# EAGLE design valves card (EAGLE 9.6.2)
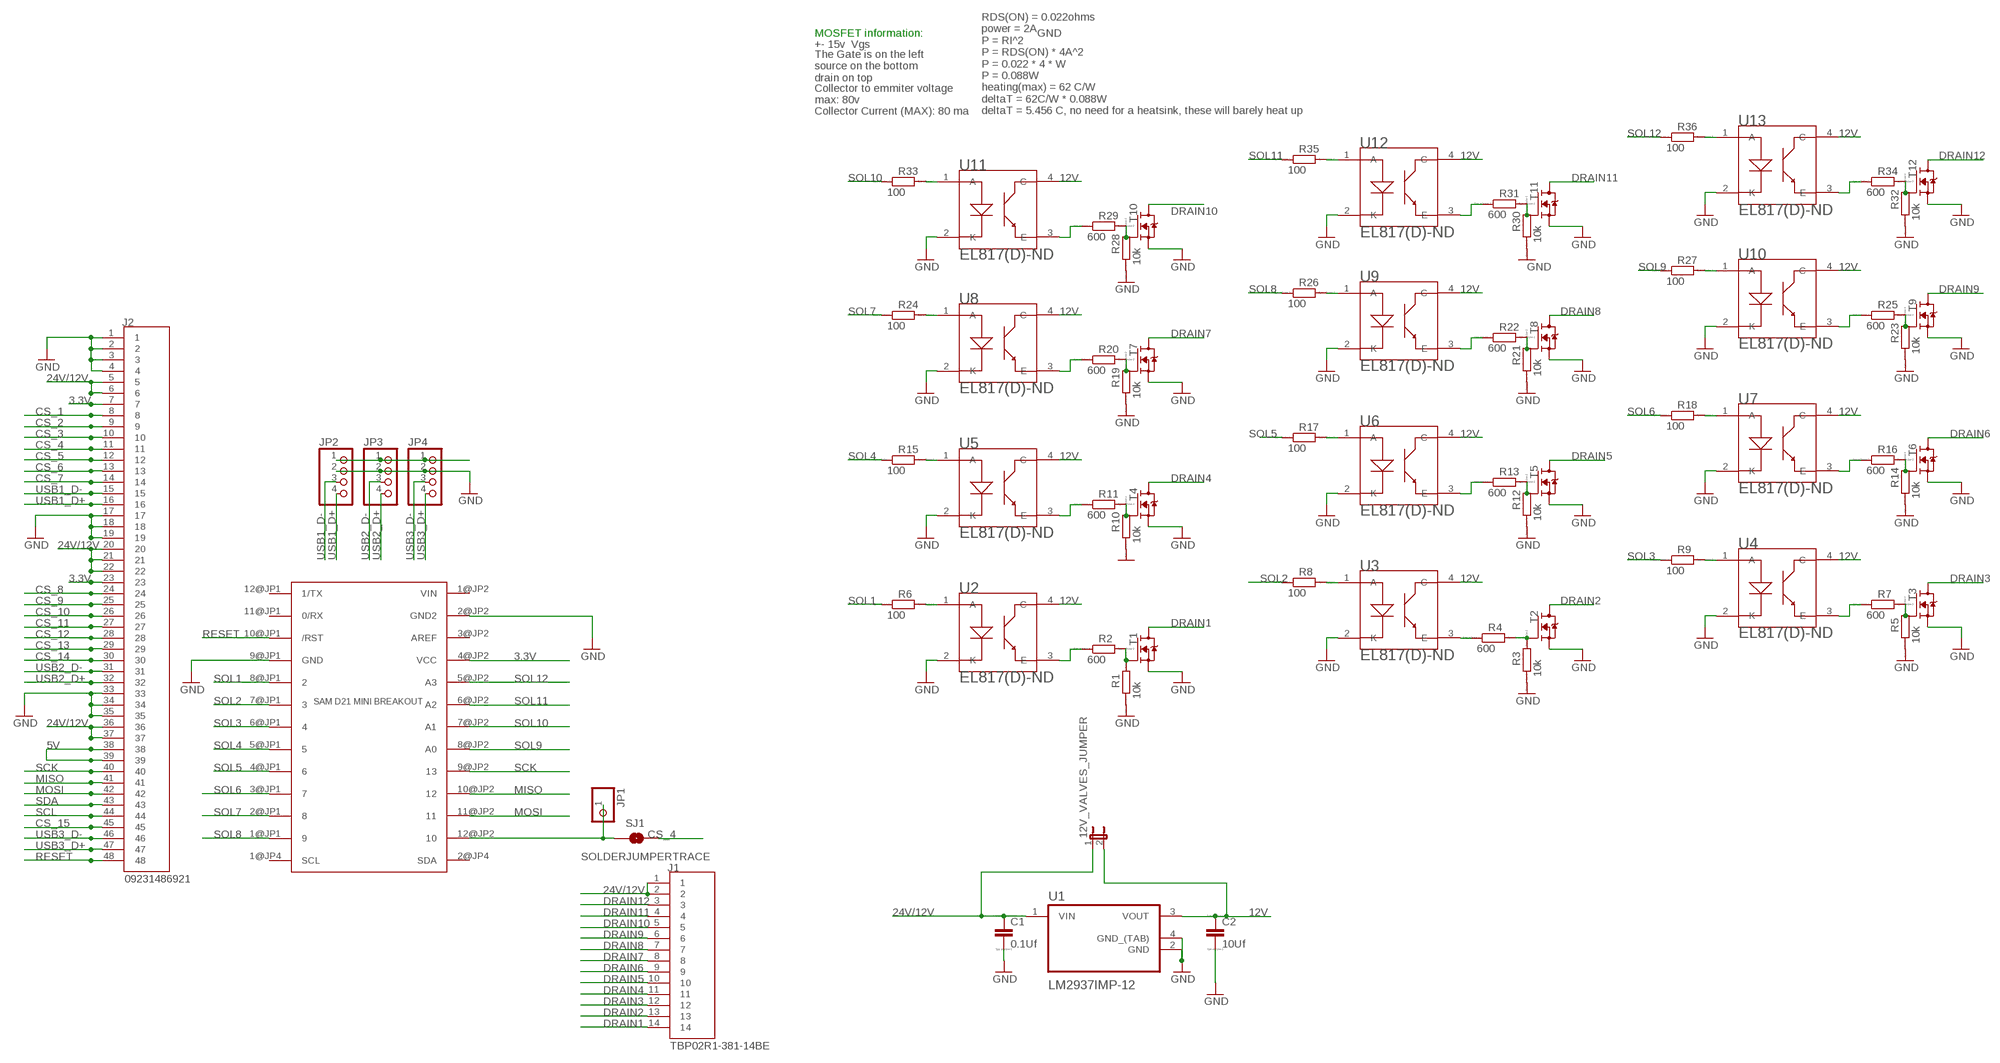
[diagram p0: schematic, sheet 1]

## Parts
12V_VALVES_JUMPER  JUMPER-2SMD-NO  [SJ_2S-NO]
C1  0.1Uf  C  [C0805]
C2  10Uf  CC1206  [C1206]
J1  TBP02R1-381-14BE  [CUI_TBP02R1-381-14BE]
J2  09231486921  [HARTING_09231486921]
JP1  PINHD-1X1  [1X01]
JP2  PINHD-1X4  [1X04]
JP3  PINHD-1X4  [1X04]
JP4  PINHD-1X4  [1X04]
M2  SAM_D21_MINI_BREAKOUT  [JP1_SPARKFUN-SAMD21-MINI-BREAKOUT-V10]
R1  10k  R  [R0805]
R2  600  R  [R0805]
R3  10k  R  [R0805]
R4  600  R  [R0805]
R5  10k  R  [R0805]
R6  100  R  [R0805]
R7  600  R  [R0805]
R8  100  R  [R0805]
R9  100  R  [R0805]
R10  10k  R  [R0805]
R11  600  R  [R0805]
R12  10k  R  [R0805]
R13  600  R  [R0805]
R14  10k  R  [R0805]
R15  100  R  [R0805]
R16  600  R  [R0805]
R17  100  R  [R0805]
R18  100  R  [R0805]
R19  10k  R  [R0805]
R20  600  R  [R0805]
R21  10k  R  [R0805]
R22  600  R  [R0805]
R23  10k  R  [R0805]
R24  100  R  [R0805]
R25  600  R  [R0805]
R26  100  R  [R0805]
R27  100  R  [R0805]
R28  10k  R  [R0805]
R29  600  R  [R0805]
R30  10k  R  [R0805]
R31  600  R  [R0805]
R32  10k  R  [R0805]
R33  100  R  [R0805]
R34  600  R  [R0805]
R35  100  R  [R0805]
R36  100  R  [R0805]
SJ1  SOLDERJUMPERTRACE  [SJ_2S-TRACE]
T1  IRLZ44NSTRLPBF  BUK9214-30A-118-DPAK  [DPAK_TO252]
T2  IRLZ44NSTRLPBF  BUK9214-30A-118-DPAK  [DPAK_TO252]
T3  IRLZ44NSTRLPBF  BUK9214-30A-118-DPAK  [DPAK_TO252]
T4  IRLZ44NSTRLPBF  BUK9214-30A-118-DPAK  [DPAK_TO252]
T5  IRLZ44NSTRLPBF  BUK9214-30A-118-DPAK  [DPAK_TO252]
T6  IRLZ44NSTRLPBF  BUK9214-30A-118-DPAK  [DPAK_TO252]
T7  IRLZ44NSTRLPBF  BUK9214-30A-118-DPAK  [DPAK_TO252]
T8  IRLZ44NSTRLPBF  BUK9214-30A-118-DPAK  [DPAK_TO252]
T9  IRLZ44NSTRLPBF  BUK9214-30A-118-DPAK  [DPAK_TO252]
T10  IRLZ44NSTRLPBF  BUK9214-30A-118-DPAK  [DPAK_TO252]
T11  IRLZ44NSTRLPBF  BUK9214-30A-118-DPAK  [DPAK_TO252]
T12  IRLZ44NSTRLPBF  BUK9214-30A-118-DPAK  [DPAK_TO252]
U1  LM2937IMP-12  LM2937IMP-10  [SOT230P700X180-4N]
U2  EL817(D)-ND  EL817C  [DIP762W25P254L650H453Q4B]
U3  EL817(D)-ND  EL817C  [DIP762W25P254L650H453Q4B]
U4  EL817(D)-ND  EL817C  [DIP762W25P254L650H453Q4B]
U5  EL817(D)-ND  EL817C  [DIP762W25P254L650H453Q4B]
U6  EL817(D)-ND  EL817C  [DIP762W25P254L650H453Q4B]
U7  EL817(D)-ND  EL817C  [DIP762W25P254L650H453Q4B]
U8  EL817(D)-ND  EL817C  [DIP762W25P254L650H453Q4B]
U9  EL817(D)-ND  EL817C  [DIP762W25P254L650H453Q4B]
U10  EL817(D)-ND  EL817C  [DIP762W25P254L650H453Q4B]
U11  EL817(D)-ND  EL817C  [DIP762W25P254L650H453Q4B]
U12  EL817(D)-ND  EL817C  [DIP762W25P254L650H453Q4B]
U13  EL817(D)-ND  EL817C  [DIP762W25P254L650H453Q4B]

## Nets
3.3V: J2.7 J2.23 M2.4@JP2(VCC)
5V: J2.38 J2.39 JP2.1 JP3.1 JP4.1
12V: 12V_VALVES_JUMPER.2 C2.1 U1.3(VOUT) U2.4(C) U3.4(C) U4.4(C) U5.4(C) U6.4(C) U7.4(C) U8.4(C) U9.4(C) U10.4(C) U11.4(C) U12.4(C) U13.4(C)
24V/12V: 12V_VALVES_JUMPER.1 C1.1 J1.1 J1.2 J2.5 J2.6 J2.20 J2.21 J2.22 J2.36 J2.37 U1.1(VIN)
CS_1: J2.8
CS_2: J2.9
CS_3: J2.10
CS_4: J2.11 SJ1.2
CS_5: J2.12
CS_6: J2.13
CS_7: J2.14
CS_8: J2.24
CS_9: J2.25
CS_10: J2.26
CS_11: J2.27
CS_12: J2.28
CS_13: J2.29
CS_14: J2.30
CS_15: J2.45
DRAIN1: J1.14 T1.2(D)
DRAIN2: J1.13 T2.2(D)
DRAIN3: J1.12 T3.2(D)
DRAIN4: J1.11 T4.2(D)
DRAIN5: J1.10 T5.2(D)
DRAIN6: J1.9 T6.2(D)
DRAIN7: J1.8 T7.2(D)
DRAIN8: J1.7 T8.2(D)
DRAIN9: J1.6 T9.2(D)
DRAIN10: J1.5 T10.2(D)
DRAIN11: J1.4 T11.2(D)
DRAIN12: J1.3 T12.2(D)
GND: C1.2 C2.2 J2.1 J2.2 J2.3 J2.4 J2.17 J2.18 J2.19 J2.33 J2.34 J2.35 JP2.2 JP3.2 JP4.2 M2.2@JP2(GND2) M2.9@JP1(GND) R1.1 R3.1 R5.1 R10.1 R12.1 R14.1 R19.1 R21.1 R23.1 R28.1 R30.1 R32.1 T1.3(S) T2.3(S) T3.3(S) T4.3(S) T5.3(S) T6.3(S) T7.3(S) T8.3(S) T9.3(S) T10.3(S) T11.3(S) T12.3(S) U1.2(GND) U1.4(GND_(TAB)) U2.2(K) U3.2(K) U4.2(K) U5.2(K) U6.2(K) U7.2(K) U8.2(K) U9.2(K) U10.2(K) U11.2(K) U12.2(K) U13.2(K)
MISO: J2.41 M2.10@JP2
MOSI: J2.42 M2.11@JP2
N$2: JP1.1 M2.12@JP2 SJ1.1
N$5: R6.2 U2.1(A)
N$10: R1.2 R2.2 T1.1(G)
N$11: R2.1 U2.3(E)
N$15: R3.2 R4.2 T2.1(G)
N$16: R4.1 U3.3(E)
N$17: R8.2 U3.1(A)
N$21: R5.2 R7.2 T3.1(G)
N$22: R7.1 U4.3(E)
N$23: R9.2 U4.1(A)
N$27: R10.2 R11.2 T4.1(G)
N$28: R11.1 U5.3(E)
N$29: R15.2 U5.1(A)
N$33: R12.2 R13.2 T5.1(G)
N$34: R13.1 U6.3(E)
N$35: R17.2 U6.1(A)
N$39: R14.2 R16.2 T6.1(G)
N$40: R16.1 U7.3(E)
N$41: R18.2 U7.1(A)
N$45: R19.2 R20.2 T7.1(G)
N$46: R20.1 U8.3(E)
N$47: R24.2 U8.1(A)
N$51: R21.2 R22.2 T8.1(G)
N$52: R22.1 U9.3(E)
N$53: R26.2 U9.1(A)
N$57: R23.2 R25.2 T9.1(G)
N$58: R25.1 U10.3(E)
N$59: R27.2 U10.1(A)
N$63: R28.2 R29.2 T10.1(G)
N$64: R29.1 U11.3(E)
N$65: R33.2 U11.1(A)
N$69: R30.2 R31.2 T11.1(G)
N$70: R31.1 U12.3(E)
N$71: R35.2 U12.1(A)
N$75: R32.2 R34.2 T12.1(G)
N$76: R34.1 U13.3(E)
N$77: R36.2 U13.1(A)
RESET: J2.48 M2.10@JP1(/RST)
SCK: J2.40 M2.9@JP2
SCL: J2.44
SDA: J2.43
SOL1: M2.8@JP1 R6.1
SOL2: M2.7@JP1 R8.1
SOL3: M2.6@JP1 R9.1
SOL4: M2.5@JP1 R15.1
SOL5: M2.4@JP1 R17.1
SOL6: M2.3@JP1 R18.1
SOL7: M2.2@JP1 R24.1
SOL8: M2.1@JP1 R26.1
SOL9: M2.8@JP2(A0) R27.1
SOL10: M2.7@JP2(A1) R33.1
SOL11: M2.6@JP2(A2) R35.1
SOL12: M2.5@JP2(A3) R36.1
USB1_D+: J2.16 JP2.4
USB1_D-: J2.15 JP2.3
USB2_D+: J2.32 JP3.4
USB2_D-: J2.31 JP3.3
USB3_D+: J2.47 JP4.4
USB3_D-: J2.46 JP4.3
Unconnected: M2.1@JP4(SCL) M2.2@JP4(SDA) M2.11@JP1(0/RX) M2.12@JP1(1/TX)

## Notes on the sheet
- MOSFET information:
- +- 15v  Vgs
- The Gate is on the left
  source on the bottom
  drain on top
- Collector to emmiter voltage 
  max: 80v
- Collector Current (MAX): 80 ma
- RDS(ON) = 0.022ohms
  power = 2A
  P = RI^2
  P = RDS(ON) * 4A^2
  P = 0.022 * 4 * W
  P = 0.088W
  heating(max) = 62 C/W
  deltaT = 62C/W * 0.088W
  deltaT = 5.456 C, no need for a heatsink, these will barely heat up

## Power pins joined to a net without a drawn wire
AREF: M2.3@JP2(AREF)
VIN: M2.1@JP2(VIN)

## Library data of the parts
12V_VALVES_JUMPER = SparkFun-Passives:JUMPER-2: Jumper Basic 0.1" spaced jumper. Use with breakaway headers.
C1 C2 = eagle-ltspice:C: CAPACITOR, European symbol; SPICEMODEL: NONE; SPICEPREFIX: C
J1 = TBP02R1-381-14BE:TBP02R1-381-14BE: Check prices <https://pricing.snapeda.com/parts/TBP02R1-381-14BE/CUI%20Devices/view-part?ref=eda>; AVAILABILITY: In Stock; CUI_PURCHASE_URL: https://www.cuidevices.com/product/interconnect/connectors/terminal-blocks/tbp02r1-381-series?utm_source=snapeda.com&utm_medium=referral&utm_campaign=snapedaBOM; DESCRIPTION: 2~24 Poles, Pluggable,Receptacle, Horizontal, 3.81 Pitch, Terminal Block Connector; MF: CUI Devices; MP: TBP02R1-381-14BE; PACKAGE: None; PRICE: None; PURCHASE-URL: https://pricing.snapeda.com/search/part/TBP02R1-381-14BE/?ref=eda
J2 = din41612_48_pin_board:09231486921: Check prices <https://pricing.snapeda.com/parts/8-1393644-0/TE%20Connectivity/view-part?ref=eda>; AVAILABILITY: In Stock; COMMENT: 09231486921; DESCRIPTION: Conn DIN 41612 M 48 POS 2.54mm Solder RA Thru-Hole Tray; EU_ROHS_COMPLIANCE: Compliant; MF: HARTING; MP: 09231486921; PACKAGE: None; PRICE: 6$; PURCHASE-URL-DIGIKEY: https://www.digikey.ca/en/products/detail/harting/09231486921/3180439
JP1 = pinhead:PINHD-1X1: PIN HEADER
JP2-JP4 = pinhead:PINHD-1X4: PIN HEADER
M2 = SparkFun-SAMD21-Mini-Breakout:SAM_D21_MINI_BREAKOUT: SPARKFUN-SAMD21-MINI-BREAKOUT; PURCHASE_URL_DIGIKEY: https://www.digikey.ca/en/products/detail/sparkfun-electronics/DEV-13664/5766914?s=N4IgTCBcDaIM4EMC2ATMBGABEglgOx0wCMAnAUwQGsB7AVwBcQBdAXyA; PURCHASE_URL_SPARKFUN: https://www.sparkfun.com/products/13664
R1-R36 = eagle-ltspice:R: RESISTOR, European symbol; SPICEMODEL: NONE; SPICEPREFIX: R
SJ1 = SparkFun-Passives:SOLDERJUMPER: Solder Jumper Standard SMD solder jumper. Used to automate production. Two varients : Normally Open and Normally Closed are the same, but have different paste layers. NC will have a large amount of paste and should jumper during reflow.
T1-T12 = BUK9214-30A,118:BUK9214-30A-118: N-Channel MOSFET SOT23 N-Chn MOSFET TSM3404, IRLML2502 (Vgs>=+/-20V, Vds<=20V, Id>=3A + Rds<=0.05Ohm @ Vgs=4.5V) BSS138 (Vgs>=+/-20V, Vds<=40V, Id>=0.2A + Rds<=3Ohm @ Vgs=4.5V) SOT223 Low Side Switch with Protection (Infineon) BSP76 (Vin=0...10V, Vds<=42V, Id=1.4A + Rds=0.2Ohm @ Vin=5V) BSP77 (Vin=0...10V, Vds<=42V, Id=2.2A + Rds=0.1Ohm @ Vin=5V) D²Pak Low Side Switch with Protection (Infineon) BTS117TC (Vin=0...10V, Vds<=60V, Id=3.5A + Rds=0.12Ohm @ Vin=5V) BTS133TC (Vin=0...10V, Vds<=60V, Id=7A + Rds=0.06Ohm @ Vin=5V) BTS141TC (Vin=0...10V, Vds<=60V, Id=12A + Rds=0.03Ohm @ Vin=5V) BTS3018TC (Vin=0...10V, Vds<=60V, Id=6A + Rds=0.02Ohm @ Vin=5V); DEVICE: BUK9214-30A,118; PACKAGE: DPAK; PURCHASE_URL_DIGIKEY: https://www.digikey.ca/en/products/detail/nexperia-usa-inc/BUK9214-30A-118/2119460
U1 = LM2937IMP-10:LM2937IMP-10: Check prices <https://pricing.snapeda.com/parts/LM2937IMP-10/Texas%20Instruments/view-part?ref=eda>; AVAILABILITY: Bad; DESCRIPTION: 500-mA, 26-V, high-PSRR, low-dropout voltage regulator 4-SOT-223 -40 to 85; MF: Texas Instruments; MP: LM2937IMP-10; PACKAGE: SOT-223-4 Texas Instruments; PRICE: None; PURCHASE-URL: https://pricing.snapeda.com/search/part/LM2937IMP-10/?ref=eda
U2 = EL817C:EL817C: Optocoupler DC-IN 1-CH Transistor DC-OUT 4-Pin PDIP Tube Check prices <https://pricing.snapeda.com/search/part/EL817%28C%29/?ref=eda>; AVAILABILITY: Bad; BEST_I_COULD_FIND: EL817(D)-ND; DESCRIPTION: Optoisolator Transistor Output 5000Vrms 1 Channel 4-DIP; MF: Everlight; MP: OR-815; PACKAGE: DIP-4 Everlight; PRICE: None
U3 = EL817C:EL817C: Optocoupler DC-IN 1-CH Transistor DC-OUT 4-Pin PDIP Tube Check prices <https://pricing.snapeda.com/search/part/EL817%28C%29/?ref=eda>; AVAILABILITY: Bad; DESCRIPTION: Optoisolator Transistor Output 5000Vrms 1 Channel 4-DIP; MF: Everlight; MP: OR-815; PACKAGE: DIP-4 Everlight; PRICE: None
U4-U13 = EL817C:EL817C: Optocoupler DC-IN 1-CH Transistor DC-OUT 4-Pin PDIP Tube Check prices <https://pricing.snapeda.com/search/part/EL817%28C%29/?ref=eda>; AVAILABILITY: Bad; DESCRIPTION: Optoisolator Transistor Output 5000Vrms 1 Channel 4-DIP; MF: Everlight; MP: EL817(C); PACKAGE: DIP-4 Everlight; PRICE: None

## Net classes
1 POWER: clearance 0.508 mm

## Board
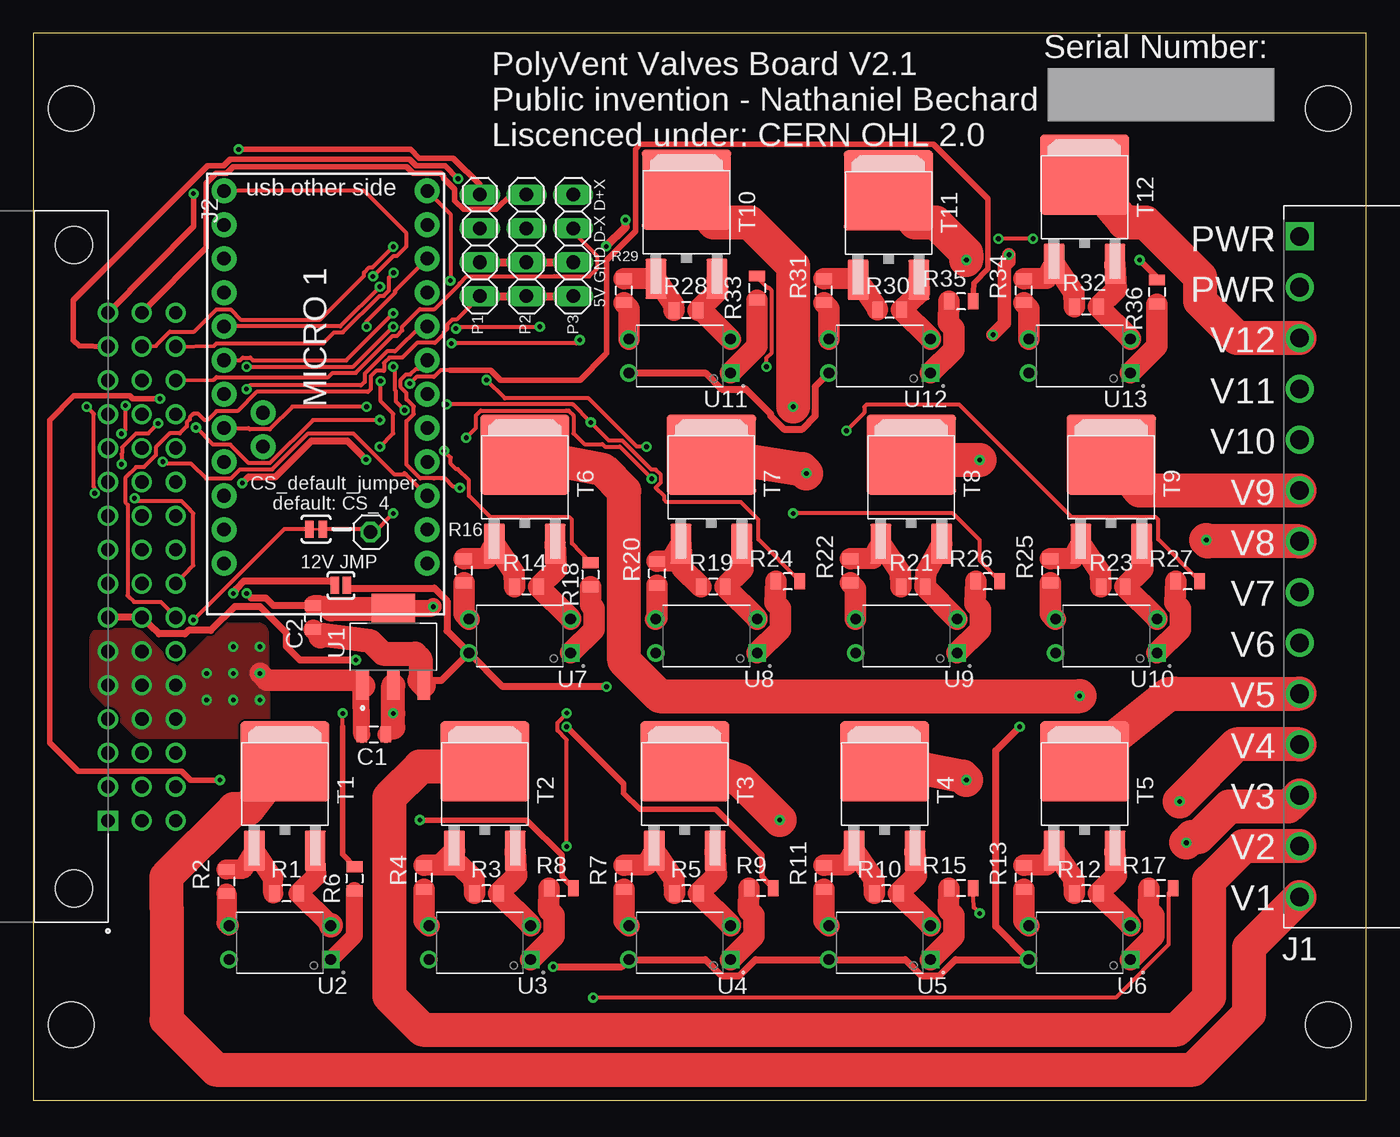
[diagram p1: board, top side]
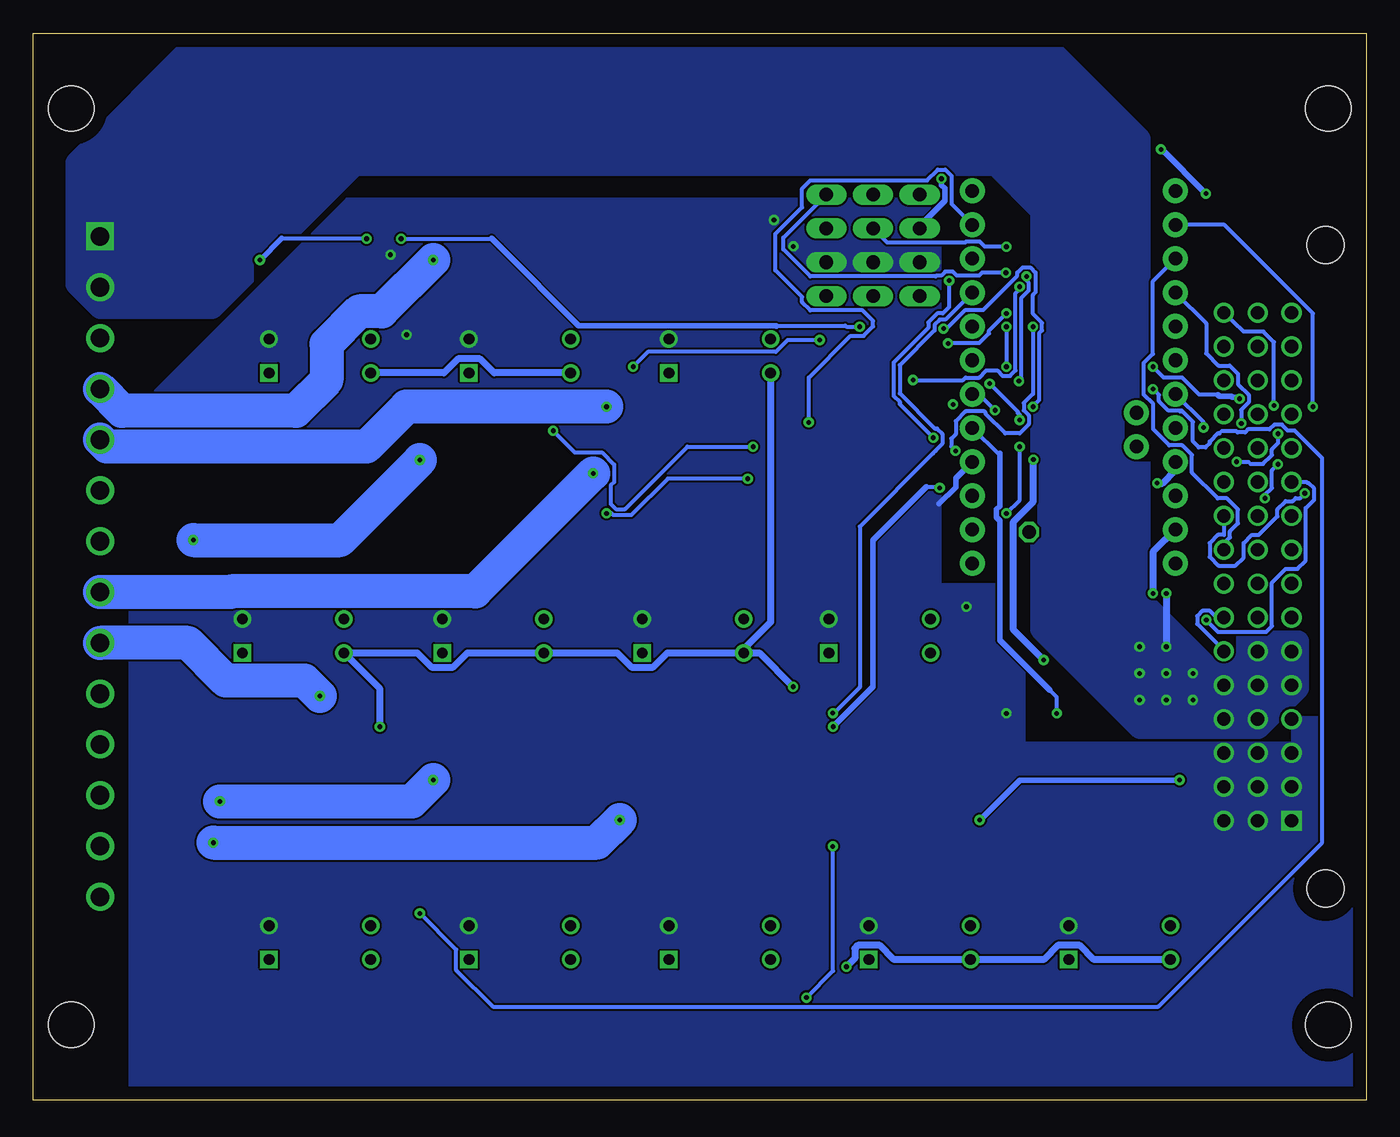
[diagram p2: board, bottom side, seen from below]

Size 100 x 80 mm. Coordinates in mm from the lower left corner, seen from the top.
Outline: 0,0 100,0 100,80 0,80 0,0
Copper layers (1*16): Top 0.035mm / dielectric 1.5mm / Bottom 0.035mm
Design rules "default": minimum track width 6mil, minimum drill 0.35mm, track to track 6mil, track to pad 6mil, pad to pad 6mil, via to via 6mil, smd to smd 6mil, copper to edge 40mil, drill to drill 6mil, minimum pad ring 10mil, minimum via ring 8mil, stop-mask expansion 4mil, vias tented up to drill 0mil, thermal gap 10mil
Holes 3.4 mm at 2.84,5.64 2.84,74.36 97.16,74.36 97.16,5.64

### Footprints (pad centres in the part's own frame; a part is rotated, then mirrored left to right if it is on the bottom)
SJ_2S-NO = smd 0.635 x 1.27: 1 -0.45,0; 2 0.45,0
0805 = smd 0.8 x 1.2: 1 -0.9,0; 2 0.9,0
CUI_TBP02R1-381-14BE = drill 1.4 square: 1 0,0 | drill 1.4: 2 3.81,0; 3 7.62,0; 4 11.43,0; 5 15.24,0; 6 19.05,0; 7 22.86,0; 8 26.67,0; 9 30.48,0; 10 34.29,0; 11 38.1,0; 12 41.91,0; 13 45.72,0; 14 49.53,0
HARTING_09231486921 = drill 1 pad 1.35 square: 1 0,0 | drill 1 pad 1.35: 2 -2.54,0; 3 -5.08,0; 4 -7.62,0; 5 -10.16,0; 6 -12.7,0; 7 -15.24,0; 8 -17.78,0; 9 -20.32,0; 10 -22.86,0; 11 -25.4,0; 12 -27.94,0; 13 -30.48,0; 14 -33.02,0; 15 -35.56,0; 16 -38.1,0; 17 0,2.54; 18 -2.54,2.54; 19 -5.08,2.54; 20 -7.62,2.54; 21 -10.16,2.54; 22 -12.7,2.54; 23 -15.24,2.54; 24 -17.78,2.54; 25 -20.32,2.54; 26 -22.86,2.54; 27 -25.4,2.54; 28 -27.94,2.54; 29 -30.48,2.54; 30 -33.02,2.54; 31 -35.56,2.54; 32 -38.1,2.54; 33 0,5.08; 34 -2.54,5.08; 35 -5.08,5.08; 36 -7.62,5.08; 37 -10.16,5.08; 38 -12.7,5.08; 39 -15.24,5.08; 40 -17.78,5.08; 41 -20.32,5.08; 42 -22.86,5.08; 43 -25.4,5.08; 44 -27.94,5.08; 45 -30.48,5.08; 46 -33.02,5.08; 47 -35.56,5.08; 48 -38.1,5.08 | hole 2.8: -43.18,-2.54; 5.08,-2.54
1X01 = drill 1.016 octagon: 1 0,0
1X04 = drill 1.016 long: 1 -3.81,0; 2 -1.27,0; 3 1.27,0; 4 3.81,0
JP1_SPARKFUN-SAMD21-MINI-BREAKOUT-V10 = drill 1.016 pad 1.88: 1@JP1 1.27,1.27; 1@JP2 16.51,29.21; 1@JP4 13.589,17.907; 2@JP1 1.27,3.81; 2@JP2 16.51,26.67; 2@JP4 13.589,20.447; 3@JP1 1.27,6.35; 3@JP2 16.51,24.13; 4@JP1 1.27,8.89; 4@JP2 16.51,21.59; 5@JP1 1.27,11.43; 5@JP2 16.51,19.05; 6@JP1 1.27,13.97; 6@JP2 16.51,16.51; 7@JP1 1.27,16.51; 7@JP2 16.51,13.97; 8@JP1 1.27,19.05; 8@JP2 16.51,11.43; 9@JP1 1.27,21.59; 9@JP2 16.51,8.89; 10@JP1 1.27,24.13; 10@JP2 16.51,6.35; 11@JP1 1.27,26.67; 11@JP2 16.51,3.81; 12@JP1 1.27,29.21; 12@JP2 16.51,1.27
SJ_2S-TRACE = smd 0.635 x 1.27: 1 -0.508,0; 2 0.508,0
DPAK_TO252 = smd 3 x 1.6: 1 2.295,-2.407; 3 2.295,2.153 | smd 6 x 6.7: 2 -4.405,-0.127
SOT230P700X180-4N = smd 2.15 x 0.95: 1 -2.9,2.3; 2 -2.9,0; 3 -2.9,-2.3 | smd 2.15 x 3.25: 4 2.9,0
DIP4 = drill 0.8 square: 1 -3.81,1.27 | drill 0.8: 2 -3.81,-1.27; 3 3.81,-1.27; 4 3.81,1.27

### Placement (x,y rotation side)
12V_VALVES_JUMPER  23.08,38.6 0 top
C1  0.1Uf, 50V  [0805]  25.54,27.43 0 top
C2  10Uf, 50V  [0805]  21,36.2 90 top
J1  95,64.77 270 top
J2  5.6,20.95 270 top
JP1  25.3,42.59 0 top
JP2  33.5,64.1 90 top
JP3  37,64.1 90 top
JP4  40.5,64.1 90 top
M2  30.82,69.45 180 top
R1  10k  [0805]  19,15.5 180 top
R2  600  [0805]  14.5,16.4 90 top
R3  10k  [0805]  34,15.5 180 top
R4  600  [0805]  29.3,16.7 90 top
R5  10k  [0805]  49,15.5 180 top
R6  100  [0805]  24.1,16.6 270 top
R7  600  [0805]  44.3,16.7 90 top
R8  100  [0805]  39.6,15.9 180 top
R9  100  [0805]  54.6,15.9 180 top
R10  10k  [0805]  64,15.5 180 top
R11  600  [0805]  59.3,16.7 90 top
R12  10k  [0805]  79,15.5 180 top
R13  600  [0805]  74.3,16.7 90 top
R14  10k  [0805]  37,38.5 180 top
R15  100  [0805]  69.6,15.9 180 top
R16  600  [0805]  32.3,39.7 90 top
R17  100  [0805]  84.6,15.9 180 top
R18  100  [0805]  41.8,39.4 270 top
R19  10k  [0805]  51,38.5 180 top
R20  600  [0805]  46.8,39.5 90 top
R21  10k  [0805]  66,38.5 180 top
R22  600  [0805]  61.3,39.7 90 top
R23  10k  [0805]  81,38.5 180 top
R24  100  [0805]  56.6,38.9 180 top
R25  600  [0805]  76.3,39.7 90 top
R26  100  [0805]  71.6,38.9 180 top
R27  100  [0805]  86.6,38.9 180 top
R28  10k  [0805]  48.97,59.25 180 top
R29  600  [0805]  44.3,60.7 90 top
R30  10k  [0805]  64.24,59.26 180 top
R31  600  [0805]  59.3,60.7 90 top
R32  10k  [0805]  79,59.5 180 top
R33  100  [0805]  54.3,60.9 270 top
R34  600  [0805]  74.3,60.7 90 top
R35  100  [0805]  69.6,59.9 180 top
R36  100  [0805]  84.3,60.6 270 top
SJ1  21.21,42.82 180 top
T1  19,21 270 top
T2  34,21 270 top
T3  49,21 270 top
T4  64,21 270 top
T5  79,21 270 top
T6  37,44 270 top
T7  51,44 270 top
T8  66,44 270 top
T9  81,44 270 top
T10  49.13,63.88 270 top
T11  64.29,63.81 270 top
T12  79,65 270 top
U1  27,34 90 top
U2  EL817(D)-ND  [DIP4]  18.5,11.8 180 top
U3  EL817(D)-ND  [DIP4]  33.5,11.8 180 top
U4  EL817(D)-ND  [DIP4]  48.5,11.8 180 top
U5  EL817(D)-ND  [DIP4]  63.5,11.8 180 top
U6  EL817(D)-ND  [DIP4]  78.5,11.8 180 top
U7  EL817(D)-ND  [DIP4]  36.5,34.8 180 top
U8  EL817(D)-ND  [DIP4]  50.5,34.8 180 top
U9  EL817(D)-ND  [DIP4]  65.5,34.8 180 top
U10  EL817(D)-ND  [DIP4]  80.5,34.8 180 top
U11  EL817(D)-ND  [DIP4]  48.5,55.8 180 top
U12  EL817(D)-ND  [DIP4]  63.5,55.8 180 top
U13  EL817(D)-ND  [DIP4]  78.5,55.8 180 top

### Tracks (layer width: path | path; a pad name or v marks a point on that pad's centre or on a via)
3.3V  (via drill 0.35)
  Top 0.508: v24.2,33 20,33 19,34 19,35 17,37 15.11,37 13.32,35.22 11.65,35.22 11.39,34.96 9.43,34.96 J2.23 J2.7 | v15.68,46.27 16.15,46.74 18.17,46.74 20.87,49.44 23.56,49.44 v24.97,48.03
  Bottom 0.508: v24.2,33 26.47,35.27 26.47,43.37 24.97,44.87 v24.97,48.03 | v15.68,46.27 15.26,46.27 14.31,47.22 M2.4@JP2
5V
  Top 0.305: J2.39 9.56,37.35 7.55,37.35 7.08,37.82 7.08,44.68 6.91,44.85 6.91,46.67 7.7,47.46 8.28,47.46 9.2,48.38 9.2,48.96 10.24,50 11,50 11.52,50.52 11.52,50.82 11.74,51.04 11.74,51.19 12.01,51.46 12.38,51.46 12.84,51 13.08,51 13.75,51.67 15.32,51.67 16.75,53.11 25.11,53.11 25.32,53.32 25.32,54.28 25.72,54.68 26.32,54.68 26.32,55.28 26.72,55.68 27.68,55.68 28.77,56.77 30.14,56.77 30.8,57.43 30.8,57.59 31.02,57.81 31.02,58.13 31.43,58.53 31.75,58.53 JP2.1
  Top 0.61: JP2.1 JP3.1 JP4.1
  Bottom 0.305: J2.38 10.68,33.71 12.68,35.72 12.68,36.28 12.28,36.68 11.72,36.68 11.27,36.24 J2.39
12V  (via drill 0.35)
  Top 0.508: v39,10 44.16,10 U4.4 50.43,10.53 51.63,9.32 52.99,9.32 54.19,10.53 U5.4 65.43,10.53 66.63,9.32 67.99,9.32 69.19,10.53 U6.4 72.2,13.02 72.2,26.2 v74,28 | v43,31 35.22,31 U7.4 | U7.4 30.61,31.45 29.05,31.45 28.95,31.45 | U12.4 58.68,53.52 58.68,51.31 57.69,50.32 56.31,50.32 55.32,51.31 55.32,51.45 53.45,53.32 51.63,53.32 50.43,54.53 U11.4 | 12V_VALVES_JUMPER.2 23.75,38.38 30.09,38.38 31.04,37.43 31.04,35.18 U7.4
  Top 1.5: C2.1 21.53,34.77
  Top 1.8: 21.53,34.77 21.53,34.89 25.31,34.41 26.23,33.48 28.66,33.48 29.05,33.09 29.05,31.45 | 28.95,31.45 U1.3
  Bottom 0.508: U2.4 20.43,10.53 21.49,11.59 23.13,11.59 24.19,10.53 U3.4 35.43,10.53 36.49,11.59 38.13,11.59 38.37,11.35 38.37,10.63 v39,10 | v74,28 74,30.84 U10.4 71.19,33.53 70.13,32.47 68.49,32.47 67.43,33.53 U9.4 56.19,33.53 55.13,32.47 53.49,32.47 52.43,33.53 47,33.53 | 47,33.53 U8.4 45.53,33.53 v43,31 | U12.4 65.43,54.53 66.49,55.59 68.13,55.59 69.19,54.53 U13.4 | U11.4 44.69,35.84 47,33.53
24V/12V  (via drill 0.35)
  Top 0.508: v15,38 15.21,38.22 15.21,38.33 15.8,38.91 22.32,38.91 12V_VALVES_JUMPER.1
  Top 1.27: C1.1 24.59,31.21
  Top 1.6: v17,32 17.5,31.5 24.3,31.5 24.59,31.21 24.75,31.05
  Top 1.8: 24.75,31.05 U1.1
  Bottom 0.508: v15,38 v15,34
  other vias: 17,34 13,32 13,30 15,30 17,30 15,32
  pour Top (no thermals): 5,34.6 5,31 8.1,27.9 17,27.9 16.86,35 14.4,35 10.8,31.4 7.6,34.6
  pour Bottom (no thermals): 75.9,70.1 86.6,59.4 95,59.4 96.8,61.2 96.8,70.3 87.4,79.7 24.6,79.7 17,72.1 17,37.6 11.3,31.9 9.1,34.1 9.1,34.4 5.1,34.4 5.1,30.9 8.1,27.9 17,27.9 24.4,35.3 24.4,66.7 27.8,70.1
CS_4  (via drill 0.35)
  Top 0.305: v12,36 18.82,42.82 SJ1.2
  Bottom 0.305: v12,36 12,35.98 11.11,35.09 7.52,35.09 7.08,35.53 7.08,38.8 6.04,39.84 5.16,39.84 4.54,40.46 4.54,44.39 3.91,45.02 3.91,45.88 4.31,46.27 4.38,46.27 4.47,46.35 J2.11
DRAIN1
  Top 2.54: T1.2 16.1,21.82 15.06,21.82 9.98,16.74 9.98,14.5 10,14.48 10,6 13.71,2.29 87,2.29 91.22,6.51 91.22,11.46 J1.14
DRAIN2
  Top 2.54: T2.2 33.77,25 29,25 26.7,22.7 26.7,7.8 29.22,5.28 85.78,5.28 88.23,7.72 88.23,16.46 90.81,19.05 J1.13
DRAIN3  (via drill 0.35)
  Top 2.54: v56,21 53.03,23.97 T3.2 | J1.12 94.14,22 89.71,22 87.42,19.71 86.91,19.71 v86.5,19.3
  Bottom 2.54: v86.5,19.3 57.7,19.3 v56,21
DRAIN4  (via drill 0.35)
  Top 2.54: J1.11 90.27,26.66 v86,22.4 | 63.5,26.5 63,26 63.9,25.1 T4.2 69.74,24.26 v70,24
  Bottom 2.54: v86,22.4 71.6,22.4 v70,24
DRAIN5
  Top 2.54: T5.2 85.21,30.45 85.55,30.45 85.58,30.48 J1.10
DRAIN6  (via drill 0.35)
  Top 2.54: 37,47.16 T6.2 42.74,47.26 44.33,45.67 44.33,32.96 46.98,30.3 v78.5,30.3
  Bottom 2.54: v78.5,30.3 79.65,31.45 85.55,31.45 88.39,34.28 J1.9
DRAIN7  (via drill 0.35)
  Top 2.54: T7.2 57.69,47.31 v58,47
  Bottom 2.54: v58,47 66.85,38.15 85.17,38.15 85.22,38.09 J1.8
DRAIN8  (via drill 0.35)
  Top 2.54: J1.7 88.09,41.91 v88,42 | v71,48 66.05,48 T8.2
  Bottom 2.54: v88,42 77,42 v71,48
DRAIN9
  Top 2.54: T9.2 83,45.72 J1.6
DRAIN10  (via drill 0.35)
  Top 2.54: T10.2 51.05,65.82 53.74,65.82 57,62.56 v57,52
  Bottom 2.54: v57,52 72,52 75,49 94.47,49 J1.5
DRAIN11  (via drill 0.35)
  Top 2.54: T11.2 66.15,65.82 67.69,65.82 70,63.51 v70,63
  Bottom 2.54: v70,63 73.85,59.15 75.55,59.15 78,56.7 78,54 80.31,51.69 93.36,51.69 J1.4
DRAIN12
  Top 2.54: T12.2 81.85,65.82 83.44,65.82 87.53,61.73 87.53,59.93 90.31,57.15 J1.3
GND  (via drill 0.35)
  Top 0.508: C2.2 18,37.1 17.44,37.66 16.34,37.66 v16,38
  Top 0.61: JP4.2 JP3.2 JP2.2 32.35,62.83 | v42.98,64.02 44.43,65.47 v44.43,66
  Top 1.016: v73.2,63.4 73.2,62.88 72.84,62.52 72.84,58.24 v72,57.4
  Top 1.27: C1.2 27,27.94 | U1.4 29.9,36.9 v30,37
  Top 1.5: 22.31,13.14 R1.1 21.25,16.8 T1.3 | 22.35,36.8 21.55,37.1 C2.2
  Top 1.6: T2.3 36.25,16.8 R3.1 37.31,13.14 U3.2 | T3.3 51.25,16.8 R5.1 52.31,13.14 U4.2 | T4.3 66.25,16.8 R10.1 67.31,13.14 U5.2 | T5.3 81.25,16.8 R12.1 82.31,13.14 U6.2 | T9.3 83.25,39.8 R23.1 84.31,36.14 U10.2 | U9.2 66.95,38.43 R21.1 66.95,39.55 T8.3 | T7.3 53.25,39.8 R19.1 54.31,36.14 U8.2 | T6.3 39.25,39.8 R14.1 40.31,36.14 U7.2 | T12.3 81.25,60.8 R32.1 82.31,57.14 U13.2 | T11.3 66.49,60.56 R30.1 67.31,57.14 U12.2 | T10.3 51.33,60.66 R28.1 50.13,59.25 U11.2
  Top 1.8: 22.31,13.14 U2.2 | 27,27.94 v27,29 U1.2 | U1.4 26.9,36.8 22.35,36.8
  Bottom 0.406: M2.9@JP1 30.79,46.62 30.79,45.96 32.04,44.71
  Bottom 0.508: M2.2@JP2 15.05,42.04 15.06,42.04 16,41.1 v16,38
  pour Bottom (no thermals): 0.1,28.7 5.6,28.7 5.6,26.8 25.6,26.8 25.6,38.7 31.9,38.7 31.9,67.6 76.5,67.6 92.8,51.3 92.8,0 0,0
MISO
  Bottom 0.305: M2.10@JP2 16,61.41 16,55.97 16.68,55.28 16.68,52.91 15.99,52.21 15.99,50.32 14.78,49.1 13.79,49.1 13.06,48.38 13.06,47.06 11.14,45.13 10.45,45.13 9.62,44.3 9.62,43.24 10.22,42.64 10.22,42.19 10.68,41.73 J2.41
MOSI  (via drill 0.35)
  Top 0.305: v4.6,45.5 4.6,45.9 4.54,45.96 4.54,51.46 v4,52
  Bottom 0.305: J2.42 10.68,42.38 11.12,42.38 11.74,41.76 11.74,40.73 11.09,40.08 9.8,40.08 9.2,40.68 9.2,41.76 8.58,42.38 8.06,42.38 6.66,43.78 6.66,44.3 6.04,44.92 5.52,44.92 5.29,45.14 4.96,45.14 v4.6,45.5 | v4,52 4,59 10.64,65.64 M2.11@JP2
N$2  (via drill 0.35)
  Top 0.305: SJ1.1 25.07,42.82 JP1.1 25.59,42.59 v27,44 | v26,49 27,50 27,51.46 26.06,52.4 v26.06,53.92 | v25.49,61.77 27.03,63.32 27.28,63.32 27.97,64 28,64 28,65 24.82,68.18 M2.12@JP2
  Bottom 0.305: v27,44 26,45 v26,49 | v26.06,53.92 25.86,54.12 25.86,60.17 25.32,60.72 25.32,61.28 25.49,61.45 v25.49,61.77
N$5
  Top 1.27: U2.1 24.1,12.32 R6.2
N$10
  Top 1.016: R1.2 18,15.5
  Top 1.5: R2.2 15.76,17.35 T1.1 18,16.6 18,15.5
N$11
  Top 1.5: R2.1 14.5,13.26 U2.3
N$15
  Top 1.6: R3.2 33.05,16.55 31.95,17.65 R4.2 30.54,17.65 T2.1
N$16
  Top 1.6: R4.1 29.3,13.46 U3.3
N$17
  Top 1.6: R8.2 38.65,14.28 39.06,13.87 39.06,12.28 U3.1
N$21
  Top 1.6: R7.2 46.01,17.65 T3.1 48.05,16.55 R5.2
N$22
  Top 1.6: R7.1 44.3,13.46 U4.3
N$23
  Top 1.6: R9.2 53.65,14.28 54.06,13.87 54.06,12.28 U4.1
N$27
  Top 1.6: R10.2 63.05,16.55 T4.1 61.01,17.65 R11.2
N$28
  Top 1.6: R11.1 59.3,13.46 U5.3
N$29
  Top 1.6: R15.2 68.65,14.28 69.06,13.87 69.06,12.28 U5.1
N$33
  Top 1.6: R13.2 76.01,17.65 T5.1 78.05,16.55 R12.2
N$34
  Top 1.6: R13.1 74.3,13.46 U6.3
N$35
  Top 1.6: R17.2 83.65,14.28 84.06,13.87 84.06,12.28 U6.1
N$39
  Top 1.6: R16.2 34.01,40.65 T6.1 36.05,39.55 R14.2
N$40
  Top 1.6: R16.1 32.3,36.46 U7.3
N$41
  Top 1.6: R18.2 41.8,37.13 42.06,36.87 42.06,35.28 U7.1
N$45
  Top 1.6: R19.2 48.66,39.89 T7.1 47.85,40.45 R20.2
N$46
  Top 1.6: R20.1 46.8,36.18 U8.3
N$47
  Top 1.6: R24.2 55.65,37.28 56.06,36.87 56.06,35.28 U8.1
N$51
  Top 1.6: R21.2 65.05,39.55 T8.1 63.01,40.65 R22.2
N$52
  Top 1.6: R22.1 61.69,38.36 U9.3
N$53
  Top 1.6: R26.2 70.65,37.21 71.06,36.8 71.06,35.28 U9.1
N$57
  Top 1.6: R23.2 80.05,39.55 T9.1 78.01,40.65 R25.2
N$58
  Top 1.6: R25.1 76.3,36.46 U10.3
N$59
  Top 1.6: R27.2 85.65,37.28 86.06,36.87 86.06,35.28 U10.1
N$63
  Top 1.6: R28.2 48.02,59.67 T10.1 46.64,61.65 R29.2
N$64
  Top 1.6: R29.1 44.69,59.36 U11.3
N$65
  Top 1.6: R33.2 54.3,56.52 U11.1
N$69
  Top 1.6: R31.2 61.71,61.65 T11.1 63.29,59.43 R30.2
N$70
  Top 1.6: R31.1 59.69,59.36 U12.3
N$71
  Top 1.6: R35.2 68.65,58.28 69.06,57.87 69.06,56.28 U12.1
N$75
  Top 1.6: R34.2 76.01,61.65 T12.1 78.05,60.55 R32.2
N$76
  Top 1.6: R34.1 74.69,59.36 U13.3
N$77
  Top 1.6: R36.2 84.3,56.52 U13.1
RESET  (via drill 0.35)
  Top 0.305: M2.10@JP1 27.93,46.94 | 27.93,46.94 27.84,47.03 | v9.72,47.87 9.87,47.71 11.86,47.71 12.96,46.62 14.83,46.62 15.51,47.3 17.94,47.3 20.64,50 24,50 27.07,46.94 27.93,46.94 | v6.61,49.97 6.92,50.28 v6.92,52.08
  Bottom 0.305: v9.72,47.87 8.83,47.87 8.67,47.7 7.75,47.7 7.08,48.37 7.08,48.81 6.61,49.28 v6.61,49.97 | J2.48 9.2,57.62 7.7,57.62 6.92,56.84 v6.92,52.08
SCK  (via drill 0.35)
  Top 0.305: J2.40 12,40.1 12,44 11.74,44.26 11.74,44.3 11.12,44.92 7.8,44.92 v7.59,45.13 | v9.37,50.75 8.62,50 7.7,50 6.66,48.96 6.66,48.5 6.62,48.46 v6.62,47.68
  Bottom 0.305: M2.9@JP2 12,58.25 12,56 11.08,55.08 10.24,55.08 9.62,54.46 9.62,53.69 8.82,52.88 8.82,52.32 9.37,51.76 v9.37,50.75 | v7.59,45.13 7.59,45.38 7.08,45.89 7.08,47.22 v6.62,47.68
SOL1  (via drill 0.35)
  Top 0.305: 23.2,28 v23.2,29 v23.21,29
  Top 0.406: R6.1 23.2,18.45 23.2,28
  Bottom 0.305: v23.21,29 23.21,30.21 23.75,30.75 | 27.5,48 27.5,48.35 M2.8@JP1
  Bottom 0.406: 23.75,30.75 27.5,34.5 27.5,43.46 27.73,43.7 27.73,44.3 27.5,44.54 27.5,48 27.5,48.5
SOL2  (via drill 0.35)
  Top 0.305: v16,55 24,55 v27,58 | v27,55 27.11,54.89 27.11,53.26 27.18,53.18 27.18,52.4 v27.85,51.73
  Top 0.406: R8.1 39.66,16.79 39.66,18.35 37,21 v29,21 | v14,24 11.79,24 11.14,24.65 3.35,24.65 1.22,26.78 1.22,51 3.03,52.81 7.23,52.81 7.44,52.6 v9.5,52.6
  Bottom 0.3: 11.14,52.91 12,52.91
  Bottom 0.305: 11.67,52.91 12,52.91 12.52,52.91 13.79,54.19 15.19,54.19 v16,55 | v27,58 v27,55 | v27.85,51.73 29.06,52.94 M2.7@JP1
  Bottom 0.406: v29,21 26,24 v14,24 | 11.14,52.91 11.01,52.78 10.13,52.78 10.06,52.71 9.61,52.71 v9.5,52.6
SOL3  (via drill 0.35)
  Top 0.305: 30.62,46.62 30.6,46.66 | v32,45.91 31.91,46 31.51,46 30.89,46.62 30.62,46.62 | 30.62,46.62 30.07,46.62 29.03,46.62 28,47.65 28,50.91 28.53,51.45 28.53,52.01 28,52.55 28,53.01 27.57,53.45 27.57,54.01 27.97,54.41 28.29,54.41 28.71,54.83 28.9,54.83 M2.6@JP1
  Top 0.406: R9.1 54.66,16.79 54.66,18.35 51.21,21.79 45.5,21.79 44.29,23 44.29,23.71 v40,28
  Bottom 0.305: 33,46 32.09,46 v32,45.91
  Bottom 0.406: v40,28 37,31 37,42 33,46
SOL4  (via drill 0.35)
  Top 0.305: v71,14 70.55,14.45 R15.1 | v15.99,53.32 16.27,53.59 24.59,53.59 24.86,53.86 24.86,54.47 26.53,56.14 27.14,56.14 29,58 29.53,58 M2.5@JP1
  Bottom 0.305: v71,14 68.27,11.27 68.27,9.75 65.52,7 15.61,7 3.31,19.31 3.31,48.14 5.37,50.21 5.89,50.21 6.33,50.65 6.89,50.65 7.25,50.29 8.86,50.29 9.09,50.07 9.65,50.07 9.76,50.17 10.83,50.17 11,50 11.12,50 11.74,49.38 11.74,49.27 12.06,48.95 12.56,48.95 13,49.39 13,50.85 13.79,51.65 13.95,51.65 14,51.7 | v15.99,53.32 15.55,52.88 15.55,52.42 14.83,51.7 14,51.7 | 13.85,51.7 14,51.7
SOL5  (via drill 0.35)
  Top 0.305: R17.1 85.17,15.52 85.17,11.65 81.2,7.68 v42,7.68 | v40.02,19.02 40.02,27.01 39.32,27.72 39.32,28.28 40.02,28.98 v40.02,29.02
  Bottom 0.305: v42,7.68 40,9.68 40,19 v40.02,19.02 | v40.02,29.02 39.95,29.02 38,30.97 38,43 32.5,48.5 32.32,48.68 31.8,49.2 31.8,49.95 32.2,50.35 32.35,50.35 35,53 35,55.11 32.39,57.72 32.39,58.13 31.99,58.53 31.57,58.53 M2.4@JP1
SOL6  (via drill 0.35)
  Top 0.305: R18.1 40.41,41.74 40.41,43.53 40.23,43.7 34.3,43.7 32.68,45.32 32.68,46.48 31.84,47.32 31.72,47.32 31.32,47.72 31.32,48.17 v30.81,48.68 | M2.3@JP1 27.14,60.69 27.14,60.53 25,58.39 v25,58
  Bottom 0.305: v25,58 25,52.97 25.68,52.28 25.68,51.72 25.32,51.35 25.32,50.68 26,50 27.09,50 28.53,51.45 28.53,51.53 28.64,51.65 30.07,51.65 30.8,50.92 30.8,49.94 31.13,49.6 31.13,49 v30.81,48.68
SOL7  (via drill 0.35)
  Top 0.305: R24.1 54.41,42.05 54.41,43.53 53.09,44.84 47.52,44.84 47.34,45.02 47.34,45.29 46.7,45.93 47.08,46.32 47.08,46.88 46.68,47.28 46.36,47.28 44.19,49.46 43.19,49.46 v41.82,50.82 40.48,52.17 v31,52.17
  Bottom 0.305: v41.82,50.82 41.82,54.18 38.68,57.32 37.72,57.32 37.03,58 37,58 37,58.44 37.78,59.22 41.7,59.22 42.33,59.85 42.33,60.24 44.32,62.23 44.32,64.96 42.33,66.95 42.33,68.35 41.7,68.98 32.95,68.98 32.15,69.78 31.58,69.78 31.11,69.31 31.11,67.2 M2.2@JP1
SOL8  (via drill 0.35)
  Top 0.305: R26.1 71,40.45 71,42 69,44 v57,44 | v46.4,46.6 44,49 42.88,49 42.69,49.19 41.34,49.19 40.53,50 40.53,51.36 40.17,51.71 40,51.71 33.57,51.71 33.22,51.36 33.22,50.41 v32.48,49.67 | M2.1@JP1 31.29,66.44 v31.29,61.45
  Bottom 0.305: v46.4,46.6 52.4,46.6 55.14,43.86 56.47,43.86 56.61,44 v57,44 | v32.48,49.67 35,52.19 35,52.35 35.46,52.81 35.46,55.3 32.85,57.91 32.85,58.32 32.18,58.99 31.77,58.99 31.29,59.47 v31.29,61.45
SOL9  (via drill 0.35)
  Top 0.305: R27.1 84.41,42.05 84.41,43.53 84.23,43.7 77.93,43.7 69.48,52.16 62.52,52.16 62.34,51.98 62.34,51.55 v61,50.2 | v34,54 35.38,52.62 41.67,52.62 45.29,49 v46,49 | v26,61 23.02,58.02 M2.8@JP2
  Bottom 0.305: v46,49 50.93,49 55.61,44.32 56.28,44.32 56.68,44.72 56.68,46.09 56.42,46.35 56.42,47.65 57.35,48.58 59.38,48.58 v61,50.2 | v34,54 30.25,54 30.07,54.19 29.03,54.19 28.5,54.72 27.68,54.72 27.28,54.32 26.72,54.32 26.32,54.72 26.32,60.51 26,60.82 v26,61
SOL10  (via drill 0.35)
  Top 0.305: v31.36,56.74 v31.37,56.74 40.74,56.74 v41,57 | v55,55 55,55.66 55.41,56.06 55.41,60.68 55.18,60.91 55.09,60.91 54,62 54.15,62 R33.1 | v27,59 23.48,55.48 16.49,55.48 16.28,55.68 15.72,55.68 15.51,55.48 M2.7@JP2
  Bottom 0.305: v41,57 43.4,57 44.29,56.11 53.89,56.11 v55,55 | v31.37,56.74 31.34,56.77 29.03,56.77 28.3,57.5 28.3,57.7 v27,59
SOL11  (via drill 0.35)
  Top 0.254: 42.9,55.9 43,56
  Top 0.305: 31.29,54.73 30.56,54.73 30.07,54.23 28.75,54.23 v28.25,53.73 | v26,51 20.99,51 17.75,47.76 16.17,47.76 14.78,49.16 13.48,49.16 v12.2,50.44
  Top 0.406: R35.1 70.55,61.25 71.63,62.33 71.63,67.6 67.55,71.68 45.53,71.68 45.17,71.32 45.17,65.17 43,63 43,56 | 42.9,55.9 41,54 35.04,54 34.3,54.73 31.29,54.73
  Bottom 0.305: v12.2,50.44 12.2,50.83 M2.6@JP2 | v26,51 26,51.39 26.14,51.53 26.14,51.62 v28.25,53.73
SOL12  (via drill 0.35)
  Top 0.305: v75,64.6 v72.4,64.6 | v38,58 31.86,58 v31.71,57.85 | v25,52 19.45,52 17.75,50.3 16.25,50.3 | 16.25,50.3 16.24,50.29 | M2.5@JP2 16.15,50.4 16.25,50.3
  Top 0.406: v83,63 84.3,61.7 R36.1
  Bottom 0.305: 81.37,64.63 75.03,64.63 v75,64.6 | v72.4,64.6 65.6,64.6 65,64 | 44.27,58.08 39.08,58.08 39,58 v38,58 | v31.71,57.85 31.48,57.85 30.07,59.27 28.73,59.27 26.17,61.83 26.17,62.06 25.77,62.46 25.2,62.46 24.8,62.06 24.8,60.58 25,60.39 25,58.96 24.32,58.28 24.32,57.72 24.54,57.49 24.54,52.49 25,52.04 v25,52
  Bottom 0.406: 44.24,58.05 44.27,58.08 59.08,58.08 65,64 65.63,64.63 | v83,63 81.37,64.63
USB1_D+  (via drill 0.35)
  Top 0.406: J2.16 12.02,65.52 v12.02,67.98 | v15.4,71.29 28.29,71.29 28.96,70.62 31.51,70.62 33.5,68.63 JP2.4
  Bottom 0.406: v12.02,67.98 15.33,71.29 v15.4,71.29
USB1_D-  (via drill 0.35)
  Top 0.406: J2.15 3.44,56.56 3,57 3,60 13.06,70.06 14.27,70.06 14.77,70.56 28.23,70.56 28.73,70.06 30.88,70.06 31.84,69.1 v31.86,69.1
  Bottom 0.406: JP2.3 33.5,65.57 31.62,67.45 31.62,68.37 31.86,68.62 v31.86,69.1
USB2_D+
  Top 0.406: J2.32 12.97,63.94 12.97,68.75 13.73,69.5 14.51,69.5 15,70 28,70 28.5,69.5 30.55,69.5 30.78,69.28 30.78,69.15 31.62,68.3 31.62,67.45 32.27,66.79 34.73,66.79 35.84,67.91 JP3.4
USB2_D-  (via drill 0.35)
  Top 0.305: J2.31 9.18,56.56 10.24,57.62 12.08,57.62 13.75,59.3 14.8,59.3 15.55,58.54 21.54,58.54 24.8,61.8 24.8,62.06 25.2,62.46 25.46,62.46 v27,64
  Bottom 0.305: v27,64 28.62,64 28.99,64.38 30.03,64.38 30.1,64.3 35.93,64.3 JP3.3
USB3_D+  (via drill 0.35)
  Top 0.305: J2.47 13.56,56.56 13.75,56.76 21.75,56.76 22.56,57.56 23.21,57.56 25.96,60.32 26.28,60.32 26.68,60.72 26.68,61.68 27.03,62.03 v27.03,62.05
  Bottom 0.305: v27.03,62.05 28.83,62.05 29.04,61.84 30.71,61.84 31.01,62.13 31.57,62.13 31.87,61.84 32.22,61.84 32.3,61.76 41.7,61.76 43.73,63.79 43.73,64.68 JP4.4
USB3_D-
  Top 0.305: J2.46 13.56,54.02 13.75,54.22 22.14,54.22 22.46,54.54 24.19,54.54 26.96,57.32 27.28,57.32 27.68,57.72 27.68,58 29,59.31 30.12,59.31 31.97,61.17 31.97,61.22 32.51,61.76 36,61.76 39.06,61.76 39.1,61.8 39.26,61.8 39.3,61.76 41.7,61.76 42.33,62.39 42.33,63.27 40.5,65.1 JP4.3

### Text on the board
tNames: Serial Number: | PolyVent Valves Board V2.1 / Public invention - Nathaniel Bechard / Liscenced under: CERN OHL 2.0 | PWR / PWR / V12 / V11 / V10 / V9 / V8 / V7 / V6 / V5 / V4 / V3 / V2 / V1 | 5V GND D-X D+X | P1 / / P2 / / P3 | MICRO 1 | CS_default_jumper / default: CS_4 | 12V JMP